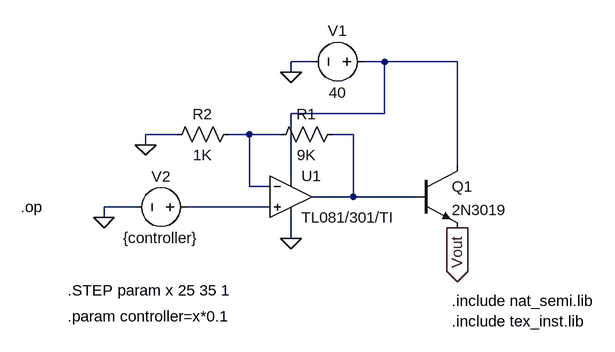
[diagram p0: schematic Problem_1.asc]
Problem_1.asc, the LTspice schematic file:
Version 4.1
SHEET 1 880 680
WIRE 256 -32 224 -32
WIRE 368 -32 336 -32
WIRE 480 -32 368 -32
WIRE 224 -16 224 -32
WIRE 368 48 368 -32
WIRE 368 48 224 48
WIRE 48 80 0 80
WIRE 160 80 128 80
WIRE 208 80 160 80
WIRE 320 80 288 80
WIRE 0 96 0 80
WIRE 480 128 480 -32
WIRE 224 144 224 48
WIRE 160 160 160 80
WIRE 192 160 160 160
WIRE 320 176 320 80
WIRE 320 176 256 176
WIRE 416 176 320 176
WIRE -16 192 -64 192
WIRE 192 192 64 192
WIRE -64 208 -64 192
WIRE 224 240 224 208
FLAG 224 240 0
FLAG 224 -16 0
FLAG 0 96 0
FLAG -64 208 0
FLAG 480 224 Vout
IOPIN 480 224 Out
SYMBOL voltage 352 -32 R90
WINDOW 0 -32 56 VBottom 2
WINDOW 3 32 56 VTop 2
SYMATTR InstName V1
SYMATTR Value 40
SYMBOL voltage 80 192 R90
WINDOW 0 -32 56 VBottom 2
WINDOW 3 32 56 VTop 2
SYMATTR InstName V2
SYMATTR Value {controller}
SYMBOL OpAmps\\opamp2 224 112 R0
SYMATTR InstName U1
SYMATTR Value TL081/301/TI
SYMBOL npn 416 128 R0
SYMATTR InstName Q1
SYMATTR Value 2N3019
SYMBOL res 304 64 R90
WINDOW 0 0 56 VBottom 2
WINDOW 3 32 56 VTop 2
SYMATTR InstName R1
SYMATTR Value 9K
SYMBOL res 144 64 R90
WINDOW 0 0 56 VBottom 2
WINDOW 3 32 56 VTop 2
SYMATTR InstName R2
SYMATTR Value 1K
TEXT -120 320 Left 2 !.STEP param x 25 35 1
TEXT -120 360 Left 2 !.param controller=x*0.1
TEXT -192 192 Left 2 !.op
TEXT 472 336 Left 2 !.include nat_semi.lib
TEXT 472 368 Left 2 !.include tex_inst.lib

The netlist it stands for:
* Problem_1.asc
V1 N001 0 40
V2 N004 0 {controller}
X§U1 N004 N002 N001 0 N003 TL081/301/TI  ; pins In+ In- V+ V- OUT
Q1 N001 N003 Vout 0 2N3019
R1 N003 N002 9K
R2 N002 0 1K
.model NPN NPN
.model PNP PNP
.lib standard.bjt
.STEP param x 25 35 1
.param controller=x*0.1
.op
.include nat_semi.lib
.include tex_inst.lib
.backanno
.end